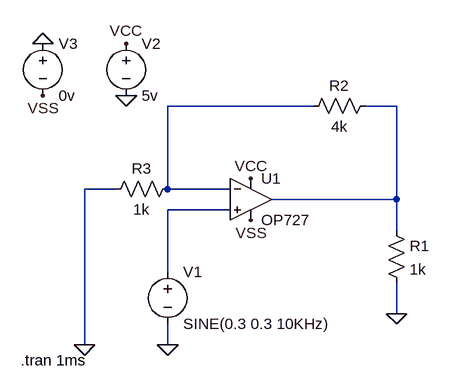
[diagram p0: schematic 6432154921-PB3.asc]
6432154921-PB3.asc, the LTspice schematic file:
Version 4
SHEET 1 880 680
WIRE 192 -176 -32 -176
WIRE 320 -176 272 -176
WIRE -112 -48 -160 -48
WIRE -32 -48 -32 -176
WIRE 64 -48 -32 -48
WIRE 320 -32 320 -176
WIRE 320 -32 128 -32
WIRE 64 -16 -32 -16
WIRE 320 16 320 -32
WIRE -32 80 -32 -16
WIRE 320 144 320 96
WIRE -160 192 -160 -48
WIRE -32 192 -32 160
FLAG 96 -64 VCC
FLAG 96 0 VSS
FLAG 320 144 0
FLAG -160 192 0
FLAG -32 192 0
FLAG -96 -192 0
FLAG -224 -272 0
FLAG -224 -192 VSS
FLAG -96 -272 VCC
SYMBOL res 304 0 R0
SYMATTR InstName R1
SYMATTR Value 1k
SYMBOL voltage -32 64 R0
WINDOW 123 0 0 Left 0
WINDOW 39 0 0 Left 0
SYMATTR InstName V1
SYMATTR Value SINE(0.3 0.3 10KHz)
SYMBOL Opamps\\OP727 96 -96 R0
SYMATTR InstName U1
SYMBOL res 288 -192 R90
WINDOW 0 0 56 VBottom 2
WINDOW 3 32 56 VTop 2
SYMATTR InstName R2
SYMATTR Value 4k
SYMBOL res -16 -64 R90
WINDOW 0 0 56 VBottom 2
WINDOW 3 32 56 VTop 2
SYMATTR InstName R3
SYMATTR Value 1k
SYMBOL voltage -96 -288 R0
WINDOW 123 0 0 Left 0
WINDOW 39 0 0 Left 0
SYMATTR InstName V2
SYMATTR Value 5v
SYMBOL voltage -224 -288 R0
WINDOW 123 0 0 Left 0
WINDOW 39 0 0 Left 0
SYMATTR InstName V3
SYMATTR Value 0v
TEXT -258 216 Left 2 !.tran 1ms

The netlist it stands for:
* 6432154921-PB3.asc
R1 N002 0 1k
V1 N003 0 SINE(0.3 0.3 10KHz)
XU1 N003 N001 VCC VSS N002 OP727  ; pins In+ In- V+ V- OUT
R2 N002 N001 4k
R3 N001 0 1k
V2 VCC 0 5v
V3 0 VSS 0v
.tran 1ms
.backanno
.end